# EAGLE design expansion (EAGLE 7.1.0)
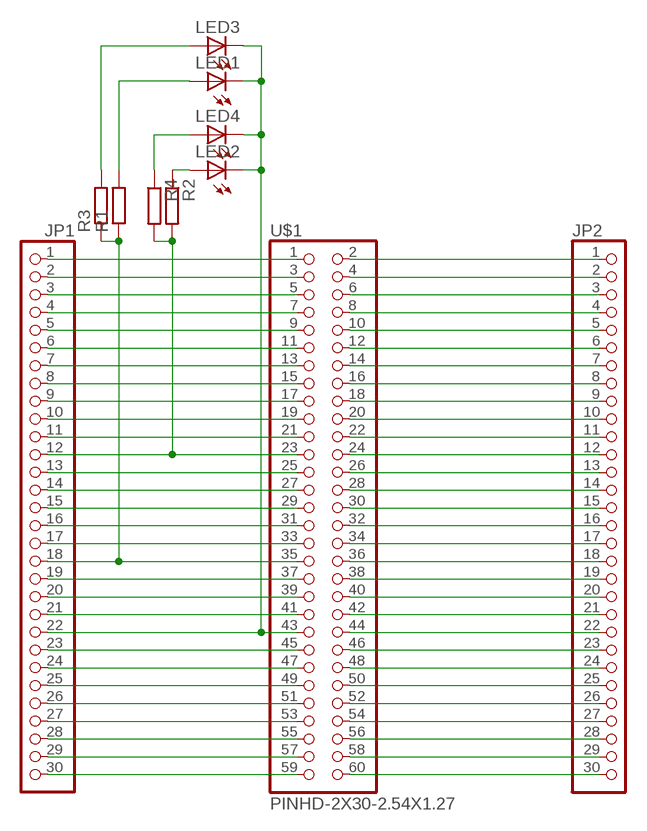
[diagram p0: schematic, sheet 1]

## Parts
JP1  PINHD-1X30  [1X30]
JP2  PINHD-1X30  [1X30]
LED1  LEDCHIP-LED0805  [CHIP-LED0805]
LED2  LEDCHIP-LED0805  [CHIP-LED0805]
LED3  LEDCHIP-LED0805  [CHIP-LED0805]
LED4  LEDCHIP-LED0805  [CHIP-LED0805]
R1  R-EU_R0805  [R0805]
R2  R-EU_R0805  [R0805]
R3  R-EU_R0805  [R0805]
R4  R-EU_R0805  [R0805]
U$1  PINHD-2X30-2.54X1.27  [PINHD-2X30-2.54X1.27]

## Nets
N$1: JP1.1 U$1.1
N$2: JP1.2 U$1.3
N$3: JP1.3 U$1.5
N$4: JP1.4 U$1.7
N$5: JP1.5 U$1.9
N$6: JP1.6 U$1.11
N$7: JP1.7 U$1.13
N$8: JP1.8 U$1.15
N$9: JP1.9 U$1.17
N$10: JP1.10 U$1.19
N$11: JP1.11 U$1.21
N$12: JP1.12 R2.2 R4.2 U$1.23
N$13: JP1.13 U$1.25
N$14: JP1.14 U$1.27
N$15: JP1.15 U$1.29
N$16: JP1.16 U$1.31
N$17: JP1.17 U$1.33
N$18: JP1.18 R1.1 R3.1 U$1.35
N$19: JP1.19 U$1.37
N$20: JP1.20 U$1.39
N$21: JP1.21 U$1.41
N$22: JP1.22 LED1.C LED2.C LED3.C LED4.C U$1.43
N$23: JP1.23 U$1.45
N$24: JP1.24 U$1.47
N$25: JP1.25 U$1.49
N$26: JP1.26 U$1.51
N$27: JP1.27 U$1.53
N$28: JP1.28 U$1.55
N$29: JP1.29 U$1.57
N$30: JP1.30 U$1.59
N$31: JP2.1 U$1.2
N$32: JP2.2 U$1.4
N$33: JP2.3 U$1.6
N$34: JP2.4 U$1.8
N$35: JP2.5 U$1.10
N$36: JP2.6 U$1.12
N$37: JP2.7 U$1.14
N$38: JP2.8 U$1.16
N$39: JP2.9 U$1.18
N$40: JP2.10 U$1.20
N$41: JP2.11 U$1.22
N$42: JP2.12 U$1.24
N$43: JP2.13 U$1.26
N$44: JP2.14 U$1.28
N$45: JP2.15 U$1.30
N$46: JP2.16 U$1.32
N$47: JP2.17 U$1.34
N$48: JP2.18 U$1.36
N$49: JP2.19 U$1.38
N$50: JP2.20 U$1.40
N$51: JP2.21 U$1.42
N$52: JP2.22 U$1.44
N$53: JP2.23 U$1.46
N$54: JP2.24 U$1.48
N$55: JP2.25 U$1.50
N$56: JP2.26 U$1.52
N$57: JP2.27 U$1.54
N$58: JP2.28 U$1.56
N$59: JP2.29 U$1.58
N$60: JP2.30 U$1.60
N$61: LED1.A R1.2
N$62: LED2.A R2.1
N$63: LED4.A R4.1
N$64: LED3.A R3.2

## Library data of the parts
JP1 JP2 = pinhead:PINHD-1X30: PIN HEADER
LED1-LED4 = led:LED: LED OSRAM: - CHIPLED LG R971, LG N971, LY N971, LG Q971, LY Q971, LO R971, LY R971 LH N974, LH R974 LS Q976, LO Q976, LY Q976 LO Q996 - Hyper CHIPLED LW Q18S LB Q993, LB Q99A, LB R99A - SideLED LS A670, LO A670, LY A670, LG A670, LP A670 LB A673, LV A673, LT A673, LW A673 LH A674 LY A675 LS A676, LA A676, LO A676, LY A676, LW A676 LS A679, LY A679, LG A679 - Hyper Micro SIDELED® LS Y876, LA Y876, LO Y876, LY Y876 LT Y87S - SmartLED LW L88C, LW L88S LB L89C, LB L89S, LG L890 LS L89K, LO L89K, LY L89K LS L896, LA L896, LO L896, LY L896 - TOPLED LS T670, LO T670, LY T670, LG T670, LP T670 LSG T670, LSP T670, LSY T670, LOP T670, LYG T670 LG T671, LOG T671, LSG T671 LB T673, LV T673, LT T673, LW T673 LH T674 LS T676, LA T676, LO T676, LY T676, LB T676, LH T676, LSB T676, LW T676 LB T67C, LV T67C, LT T67C, LS T67K, LO T67K, LY T67K, LW E67C LS E67B, LA E67B, LO E67B, LY E67B, LB E67C, LV E67C, LT E67C LW T67C LS T679, LY T679, LG T679 LS T770, LO T770, LY T770, LG T770, LP T770 LB T773, LV T773, LT T773, LW T773 LH T774 LS E675, LA E675, LY E675, LS T675 LS T776, LA T776, LO T776, LY T776, LB T776 LHGB T686 LT T68C, LB T68C - Hyper Mini TOPLED® LB M676 - Mini TOPLED Santana® LG M470 LS M47K, LO M47K, LY M47K Source: http://www.osram.convergy.de LUXEON: - LUMILED® LXK2-PW12-R00, LXK2-PW12-S00, LXK2-PW14-U00, LXK2-PW14-V00 LXK2-PM12-R00, LXK2-PM12-S00, LXK2-PM14-U00 LXK2-PE12-Q00, LXK2-PE12-R00, LXK2-PE12-S00, LXK2-PE14-T00, LXK2-PE14-U00 LXK2-PB12-K00, LXK2-PB12-L00, LXK2-PB12-M00, LXK2-PB14-N00, LXK2-PB14-P00, LXK2-PB14-Q00 LXK2-PR12-L00, LXK2-PR12-M00, LXK2-PR14-Q00, LXK2-PR14-R00 LXK2-PD12-Q00, LXK2-PD12-R00, LXK2-PD12-S00 LXK2-PH12-R00, LXK2-PH12-S00 LXK2-PL12-P00, LXK2-PL12-Q00, LXK2-PL12-R00 Source: www.luxeon.com KINGBRIGHT: KA-3528ASYC Source: www.kingbright.com
R1-R4 = rcl:R-EU_: RESISTOR, European symbol
U$1 = kaibader:PINHD-2X30-2.54X1.27

## Board
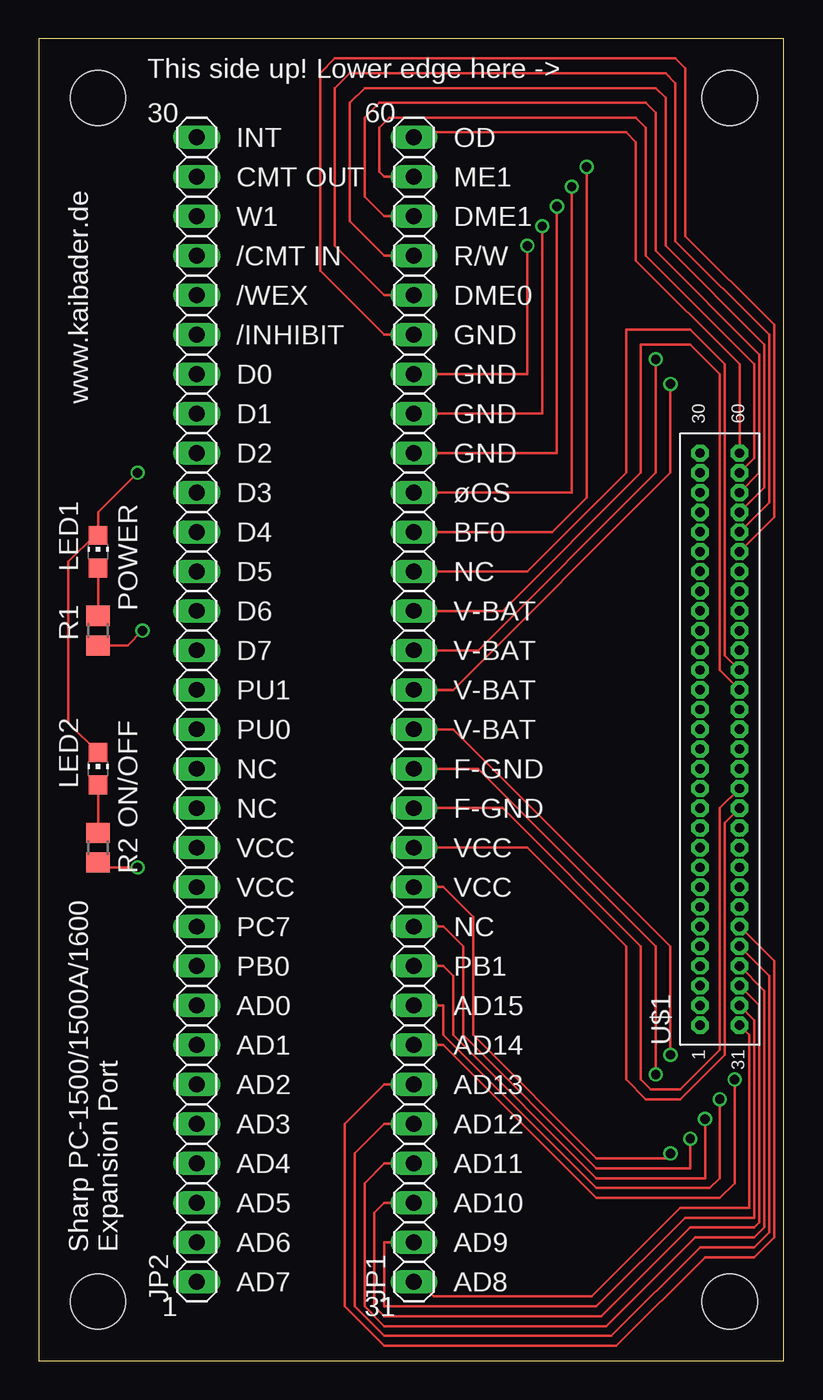
[diagram p1: board, top side]
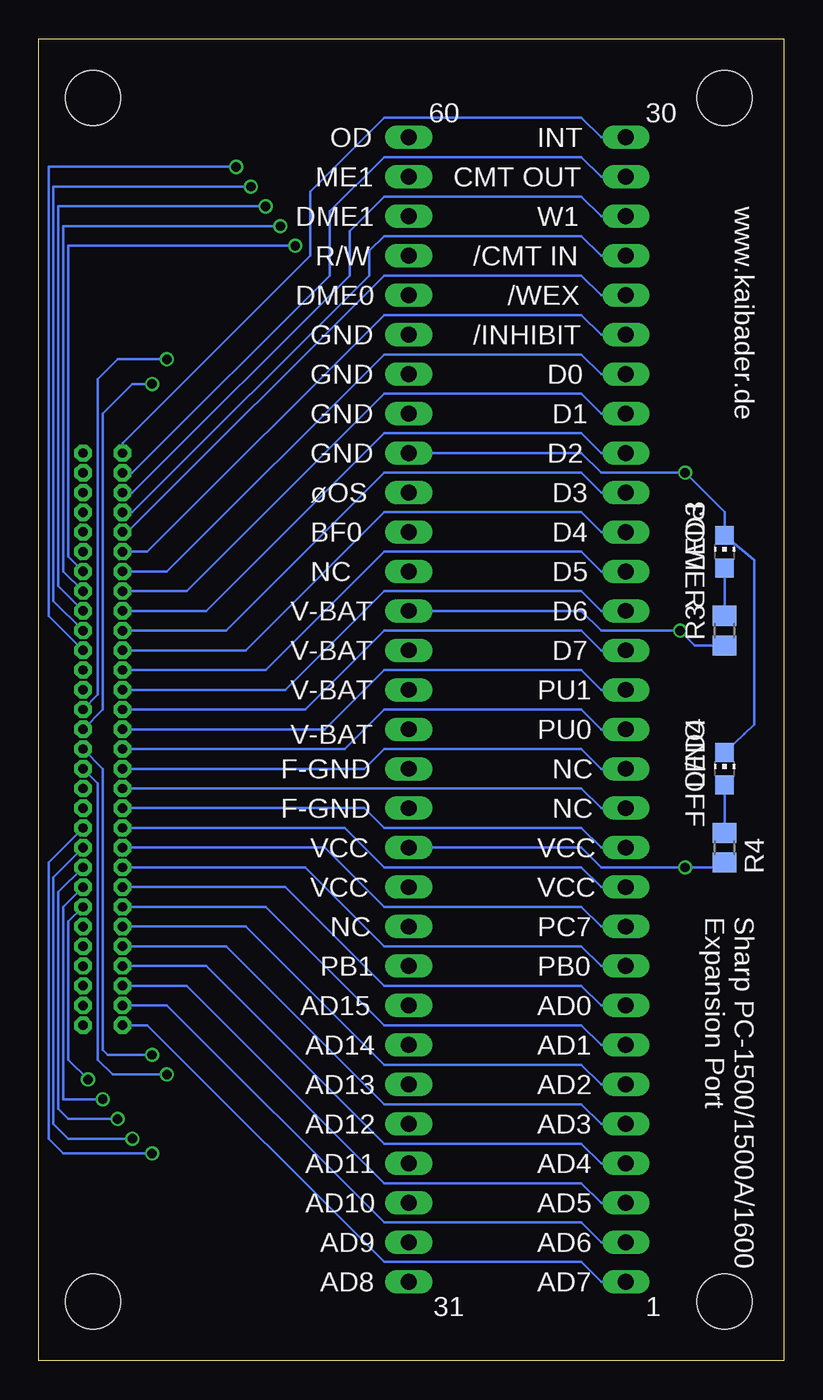
[diagram p2: board, bottom side, seen from below]

Size 47.93 x 85.08 mm. Coordinates in mm from the lower left corner, seen from the top.
Outline: 0,0 47.93,0 47.93,85.08 0,85.08 0,0
Copper layers (1*16): Top 0.035mm / dielectric 1.5mm / Bottom 0.035mm
Design rules "ITEADstudio_DRC": minimum track width 6mil, minimum drill 12mil, track to track 6mil, track to pad 6mil, pad to pad 6mil, via to via 6mil, smd to smd 0mil, copper to edge 10mil, drill to drill 10mil, minimum pad ring 10mil, minimum via ring 6mil, stop-mask expansion 2mil, vias tented up to drill 100mil, thermal gap 10mil
Holes 3.56 mm at 44.45,81.28 3.81,81.28 3.81,3.81 44.45,3.81

### Footprints (pad centres in the part's own frame; a part is rotated, then mirrored left to right if it is on the bottom)
1X30 = drill 1.016 long: 1 -36.83,0; 2 -34.29,0; 3 -31.75,0; 4 -29.21,0; 5 -26.67,0; 6 -24.13,0; 7 -21.59,0; 8 -19.05,0; 9 -16.51,0; 10 -13.97,0; 11 -11.43,0; 12 -8.89,0; 13 -6.35,0; 14 -3.81,0; 15 -1.27,0; 16 1.27,0; 17 3.81,0; 18 6.35,0; 19 8.89,0; 20 11.43,0; 21 13.97,0; 22 16.51,0; 23 19.05,0; 24 21.59,0; 25 24.13,0; 26 26.67,0; 27 29.21,0; 28 31.75,0; 29 34.29,0; 30 36.83,0
CHIP-LED0805 = smd 1.2 x 1.2: A 0,-1.05; C 0,1.05
R0805 = smd 1.3 x 1.5: 1 -0.95,0; 2 0.95,0
PINHD-2X30-2.54X1.27 = drill 0.6 pad 0.914 octagon: 1 -17.78,-1.27; 2 -17.78,1.27; 3 -16.51,-1.27; 4 -16.51,1.27; 5 -15.24,-1.27; 6 -15.24,1.27; 7 -13.97,-1.27; 8 -13.97,1.27; 9 -12.7,-1.27; 10 -12.7,1.27; 11 -11.43,-1.27; 12 -11.43,1.27; 13 -10.16,-1.27; 14 -10.16,1.27; 15 -8.89,-1.27; 16 -8.89,1.27; 17 -7.62,-1.27; 18 -7.62,1.27; 19 -6.35,-1.27; 20 -6.35,1.27; 21 -5.08,-1.27; 22 -5.08,1.27; 23 -3.81,-1.27; 24 -3.81,1.27; 25 -2.54,-1.27; 26 -2.54,1.27; 27 -1.27,-1.27; 28 -1.27,1.27; 29 0,-1.27; 30 0,1.27; 31 1.27,-1.27; 32 1.27,1.27; 33 2.54,-1.27; 34 2.54,1.27; 35 3.81,-1.27; 36 3.81,1.27; 37 5.08,-1.27; 38 5.08,1.27; 39 6.35,-1.27; 40 6.35,1.27; 41 7.62,-1.27; 42 7.62,1.27; 43 8.89,-1.27; 44 8.89,1.27; 45 10.16,-1.27; 46 10.16,1.27; 47 11.43,-1.27; 48 11.43,1.27; 49 12.7,-1.27; 50 12.7,1.27; 51 13.97,-1.27; 52 13.97,1.27; 53 15.24,-1.27; 54 15.24,1.27; 55 16.51,-1.27; 56 16.51,1.27; 57 17.78,-1.27; 58 17.78,1.27; 59 19.05,-1.27; 60 19.05,1.27

### Placement (x,y rotation side)
JP1  24.13,41.91 90 top
JP2  10.16,41.91 90 top
LED1  3.81,52.07 0 top
LED2  3.81,38.1 0 top
LED3  3.81,52.07 0 bottom
LED4  3.81,38.1 0 bottom
R1  3.81,46.99 90 top
R2  3.81,33.02 270 top
R3  3.81,46.99 90 bottom
R4  3.81,33.02 270 bottom
U$1  43.81,39.37 90 top

### Tracks (layer width: path | path; a pad name or v marks a point on that pad's centre or on a via)
N$1
  Top 0.152: U$1.1 45.72,20.95 45.72,9.84 41.27,9.84 35.56,4.13 25.4,4.13 24.45,5.08 JP1.1
N$2
  Top 0.152: U$1.3 46.04,21.91 46.04,9.21 41.59,9.21 35.88,3.49 22.23,3.49 22.23,7.62 JP1.2
N$3
  Top 0.152: U$1.5 46.35,22.86 46.35,8.89 46.04,8.57 41.91,8.57 36.2,2.86 22.23,2.86 21.59,3.49 21.59,9.53 22.23,10.16 JP1.3
N$4
  Top 0.152: U$1.7 46.67,23.81 46.67,8.57 46.04,7.94 42.23,7.94 36.51,2.22 22.23,2.22 20.95,3.49 20.95,11.43 22.23,12.7 JP1.4
N$5
  Top 0.152: U$1.9 46.99,24.77 46.99,8.26 46.04,7.3 42.55,7.3 36.83,1.59 22.23,1.59 20.32,3.49 20.32,13.34 22.23,15.24 JP1.5
N$6
  Top 0.152: U$1.11 47.31,25.72 47.31,7.94 46.04,6.67 42.86,6.67 37.15,0.95 22.23,0.95 19.68,3.49 19.68,15.24 22.23,17.78 JP1.6
N$7  (via drill 0.6)
  Top 0.152: JP1.7 26.04,20.32 35.88,10.48 43.81,10.48 44.77,11.43 v44.77,18.1
  Bottom 0.152: U$1.13 46.04,28.26 46.04,19.37 v44.77,18.1
N$8  (via drill 0.6)
  Top 0.152: JP1.8 26.04,22.86 26.04,20.95 35.88,11.11 43.18,11.11 43.81,11.75 v43.81,16.83
  Bottom 0.152: U$1.15 46.35,29.21 46.35,16.83 v43.81,16.83
N$9  (via drill 0.6)
  Top 0.152: JP1.9 26.04,25.4 26.67,24.77 26.67,20.95 35.88,11.75 42.86,11.75 v42.86,15.56
  Bottom 0.152: U$1.17 46.67,30.16 46.67,16.19 46.04,15.56 v42.86,15.56
N$10  (via drill 0.6)
  Top 0.152: JP1.10 26.04,27.94 27.3,26.67 27.3,20.95 35.88,12.38 41.91,12.38 v41.91,14.29
  Bottom 0.152: U$1.19 46.99,31.11 46.99,15.24 46.04,14.29 v41.91,14.29
N$11  (via drill 0.6)
  Top 0.152: JP1.11 26.04,30.48 27.94,28.57 27.94,20.95 35.88,13.02 40.32,13.02 v40.64,13.34
  Bottom 0.152: U$1.21 47.31,32.07 47.31,14.29 46.35,13.34 v40.64,13.34
N$12  (via drill 0.6)
  Top 0.152: U$1.23 44.13,34.61 44.13,19.68 41.27,16.83 39.05,16.83 37.78,18.1 37.78,26.67 31.43,33.02 JP1.12 | R4.2 4.13,31.75 v6.35,31.75
  Bottom 0.152: JP1.12 13.02,33.02 11.75,31.75 v6.35,31.75 4.45,31.75 4.12,32.07 R4.2
N$13
  Top 0.152: U$1.25 43.81,35.56 43.81,20 41.27,17.46 39.37,17.46 38.73,18.1 38.73,26.67 29.84,35.56 JP1.13
N$14  (via drill 0.6)
  Top 0.152: JP1.14 28.26,38.1 39.69,26.67 v39.69,18.41
  Bottom 0.152: U$1.27 44.13,37.15 44.13,19.37 43.18,18.41 v39.69,18.41
N$15  (via drill 0.6)
  Top 0.152: JP1.15 26.67,40.64 40.64,26.67 v40.64,19.68
  Bottom 0.152: U$1.29 43.81,38.1 43.81,20 43.5,19.68 v40.64,19.68
N$16  (via drill 0.6)
  Top 0.152: JP1.16 26.67,43.18 40.64,57.15 v40.64,62.87
  Bottom 0.152: U$1.31 43.81,41.91 43.81,60.96 41.91,62.87 v40.64,62.87
N$17  (via drill 0.6)
  Top 0.152: JP1.17 28.26,45.72 39.69,57.15 v39.69,64.45
  Bottom 0.152: U$1.33 44.13,42.86 44.13,63.18 42.86,64.45 v39.69,64.45
N$18  (via drill 0.6)
  Top 0.152: U$1.35 43.81,44.45 43.81,63.5 41.91,65.41 38.73,65.41 38.73,57.15 29.84,48.26 JP1.18 | R3.1 5.71,46.04 v6.67,46.99
  Bottom 0.152: JP1.18 13.02,48.26 11.75,46.99 v6.67,46.99 5.72,46.04 R3.1
N$19
  Top 0.152: U$1.37 44.13,45.4 44.13,64.14 41.91,66.36 37.78,66.36 37.78,57.15 31.43,50.8 JP1.19
N$20  (via drill 0.6)
  Top 0.152: JP1.20 33.02,53.34 35.24,55.56 v35.24,76.83
  Bottom 0.152: U$1.39 47.31,47.94 47.31,76.83 v35.24,76.83
N$21  (via drill 0.6)
  Top 0.152: JP1.21 34.29,55.88 v34.29,75.56
  Bottom 0.152: U$1.41 46.99,48.9 46.99,75.56 v34.29,75.56
N$22  (via drill 0.6)
  Top 0.152: v6.35,57.15 3.81,54.61 LED3.C 3.59,53.12 1.91,51.44 1.91,41.05 LED4.C | JP1.22 33.34,58.42 v33.34,74.3
  Bottom 0.152: U$1.43 46.67,49.85 46.67,74.3 v33.34,74.3 | JP1.22 13.02,58.42 11.75,57.15 v6.35,57.15 3.81,54.61 LED3.C 1.91,51.53 1.91,40.96 2.54,40.32 LED4.C
N$23  (via drill 0.6)
  Top 0.152: JP1.23 32.38,60.96 v32.38,73.03
  Bottom 0.152: U$1.45 46.35,50.8 46.35,73.03 v32.38,73.03
N$24  (via drill 0.6)
  Top 0.152: JP1.24 31.43,63.5 v31.43,71.75
  Bottom 0.152: U$1.47 46.04,51.75 46.04,71.75 v31.43,71.75
N$25
  Top 0.152: U$1.49 47.31,54.29 47.31,66.67 41.59,72.39 41.59,83.19 40.96,83.82 19.05,83.82 18.1,82.87 18.1,70.17 22.23,66.04 JP1.25
N$26
  Top 0.152: U$1.51 46.99,55.24 46.99,66.04 40.96,72.07 40.96,82.23 40.32,82.87 20,82.87 19.05,81.92 19.05,71.75 22.23,68.58 JP1.26
N$27
  Top 0.152: U$1.53 46.67,56.2 46.67,65.41 40.32,71.75 40.32,81.28 39.69,81.92 20.95,81.92 20,80.96 20,73.34 22.23,71.12 JP1.27
N$28
  Top 0.152: U$1.55 46.35,57.15 46.35,64.77 39.69,71.44 39.69,80.33 39.05,80.96 21.91,80.96 20.95,80.01 20.95,74.93 22.23,73.66 JP1.28
N$29
  Top 0.152: U$1.57 46.04,58.1 46.04,64.14 39.05,71.12 39.05,79.38 38.42,80.01 22.54,80.01 21.91,79.38 21.91,76.52 22.23,76.2 JP1.29
N$30
  Top 0.152: U$1.59 45.09,64.14 38.42,70.8 38.42,78.42 37.78,79.06 24.45,79.06 JP1.30
N$31
  Bottom 0.152: JP2.1 11.75,5.08 13.02,6.35 25.72,6.35 40.96,21.59 U$1.2
N$32
  Bottom 0.152: JP2.2 11.75,7.62 13.02,8.89 25.72,8.89 39.69,22.86 U$1.4
N$33
  Bottom 0.152: JP2.3 11.75,10.16 13.02,11.43 25.72,11.43 38.42,24.13 U$1.6
N$34
  Bottom 0.152: JP2.4 11.75,12.7 13.02,13.97 25.72,13.97 37.15,25.4 U$1.8
N$35
  Bottom 0.152: JP2.5 11.75,15.24 13.02,16.51 25.72,16.51 35.88,26.67 U$1.10
N$36
  Bottom 0.152: JP2.6 11.75,17.78 13.02,19.05 25.72,19.05 34.61,27.94 U$1.12
N$37
  Bottom 0.152: JP2.7 11.75,20.32 13.02,21.59 25.72,21.59 33.34,29.21 U$1.14
N$38
  Bottom 0.152: JP2.8 11.75,22.86 13.02,24.13 25.72,24.13 32.07,30.48 U$1.16
N$39
  Bottom 0.152: JP2.9 11.75,25.4 13.02,26.67 25.72,26.67 30.8,31.75 U$1.18
N$40
  Bottom 0.152: JP2.10 11.75,27.94 13.02,29.21 25.72,29.21 29.53,33.02 U$1.20
N$41
  Bottom 0.152: JP2.11 11.75,30.48 13.02,31.75 25.72,31.75 28.26,34.29 U$1.22
N$42
  Bottom 0.152: JP2.12 11.75,33.02 13.02,34.29 25.72,34.29 26.99,35.56 U$1.24
N$43
  Bottom 0.152: JP2.13 11.75,35.56 13.02,36.83 U$1.26
N$44
  Bottom 0.152: JP2.14 11.75,38.1 13.02,39.37 25.72,39.37 26.99,38.1 U$1.28
N$45
  Bottom 0.152: JP2.15 11.75,40.64 13.02,41.91 25.72,41.91 28.26,39.37 U$1.30
N$46
  Bottom 0.152: JP2.16 11.75,43.18 13.02,44.45 25.72,44.45 29.53,40.64 U$1.32
N$47
  Bottom 0.152: JP2.17 11.75,45.72 13.02,46.99 25.72,46.99 30.8,41.91 U$1.34
N$48
  Bottom 0.152: JP2.18 11.75,48.26 13.02,49.53 25.72,49.53 32.07,43.18 U$1.36
N$49
  Bottom 0.152: JP2.19 11.75,50.8 13.02,52.07 25.72,52.07 33.34,44.45 U$1.38
N$50
  Bottom 0.152: JP2.20 11.75,53.34 13.02,54.61 25.72,54.61 34.61,45.72 U$1.40
N$51
  Bottom 0.152: JP2.21 11.75,55.88 13.02,57.15 25.72,57.15 35.88,46.99 U$1.42
N$52
  Bottom 0.152: JP2.22 11.75,58.42 13.02,59.69 25.72,59.69 37.15,48.26 U$1.44
N$53
  Bottom 0.152: JP2.23 11.75,60.96 13.02,62.23 25.72,62.23 38.42,49.53 U$1.46
N$54
  Bottom 0.152: JP2.24 11.75,63.5 13.02,64.77 25.72,64.77 39.69,50.8 U$1.48
N$55
  Bottom 0.152: JP2.25 11.75,66.04 13.02,67.31 25.72,67.31 40.96,52.07 U$1.50
N$56
  Bottom 0.152: JP2.26 11.75,68.58 13.02,69.85 25.72,69.85 42.23,53.34 U$1.52
N$57
  Bottom 0.152: JP2.27 11.75,71.12 13.02,72.39 25.72,72.39 26.67,71.44 26.67,69.85 41.91,54.61 U$1.54
N$58
  Bottom 0.152: JP2.28 11.75,73.66 13.02,74.93 25.72,74.93 27.94,72.71 27.94,69.85 41.91,55.88 U$1.56
N$59
  Bottom 0.152: JP2.29 11.75,76.2 13.02,77.47 25.72,77.47 29.21,73.98 29.21,69.85 41.91,57.15 U$1.58
N$60
  Bottom 0.152: JP2.30 11.75,78.74 13.02,80.01 25.72,80.01 30.48,75.25 30.48,71.12 42.55,59.05 U$1.60
N$61
  Top 0.152: R1.2 LED1.A
N$62
  Top 0.152: R2.1 LED2.A
N$63
  Bottom 0.152: R4.1 LED4.A
N$64
  Bottom 0.152: LED3.A R3.2

### Text on the board
tPlace: This side up! Lower edge here -> | 30 | 60 | INT | OD | CMT OUT | ME1 | W1 | DME1 | /CMT IN | R/W | /WEX | DME0 | /INHIBIT | GND | D0 | GND | www.kaibader.de | D1 | GND | 30 | 60 | D2 | GND | D3 | øOS | D4 | BF0 | D5 | NC | POWER | D6 | V-BAT | D7 | V-BAT | PU1 | V-BAT | PU0 | V-BAT | NC | F-GND | NC | F-GND | ON/OFF | VCC | VCC | VCC | VCC | PC7 | NC | PB0 | PB1 | AD0 | AD15 | AD1 | AD14 | 1 | 31 | AD2 | AD13 | AD3 | AD12 | AD4 | AD11 | AD5 | AD10 | Sharp PC-1500/1500A/1600 / Expansion Port | AD6 | AD9 | AD7 | AD8 | 1 | 31
bPlace: 30 | 60 | INT | OD | CMT OUT | ME1 | www.kaibader.de | W1 | DME1 | /CMT IN | R/W | /WEX | DME0 | /INHIBIT | GND | D0 | GND | D1 | GND | D2 | GND | POWER | D3 | øOS | D4 | BF0 | D5 | NC | D6 | V-BAT | D7 | V-BAT | PU1 | V-BAT | ON/OFF | PU0 | V-BAT | NC | F-GND | NC | F-GND | VCC | VCC | VCC | VCC | Sharp PC-1500/1500A/1600 / Expansion Port | PC7 | NC | PB0 | PB1 | AD0 | AD15 | AD1 | AD14 | AD2 | AD13 | AD3 | AD12 | AD4 | AD11 | AD5 | AD10 | AD6 | AD9 | AD7 | AD8 | 1 | 31